# EAGLE design gpio4s5 (EAGLE 7.2.0)
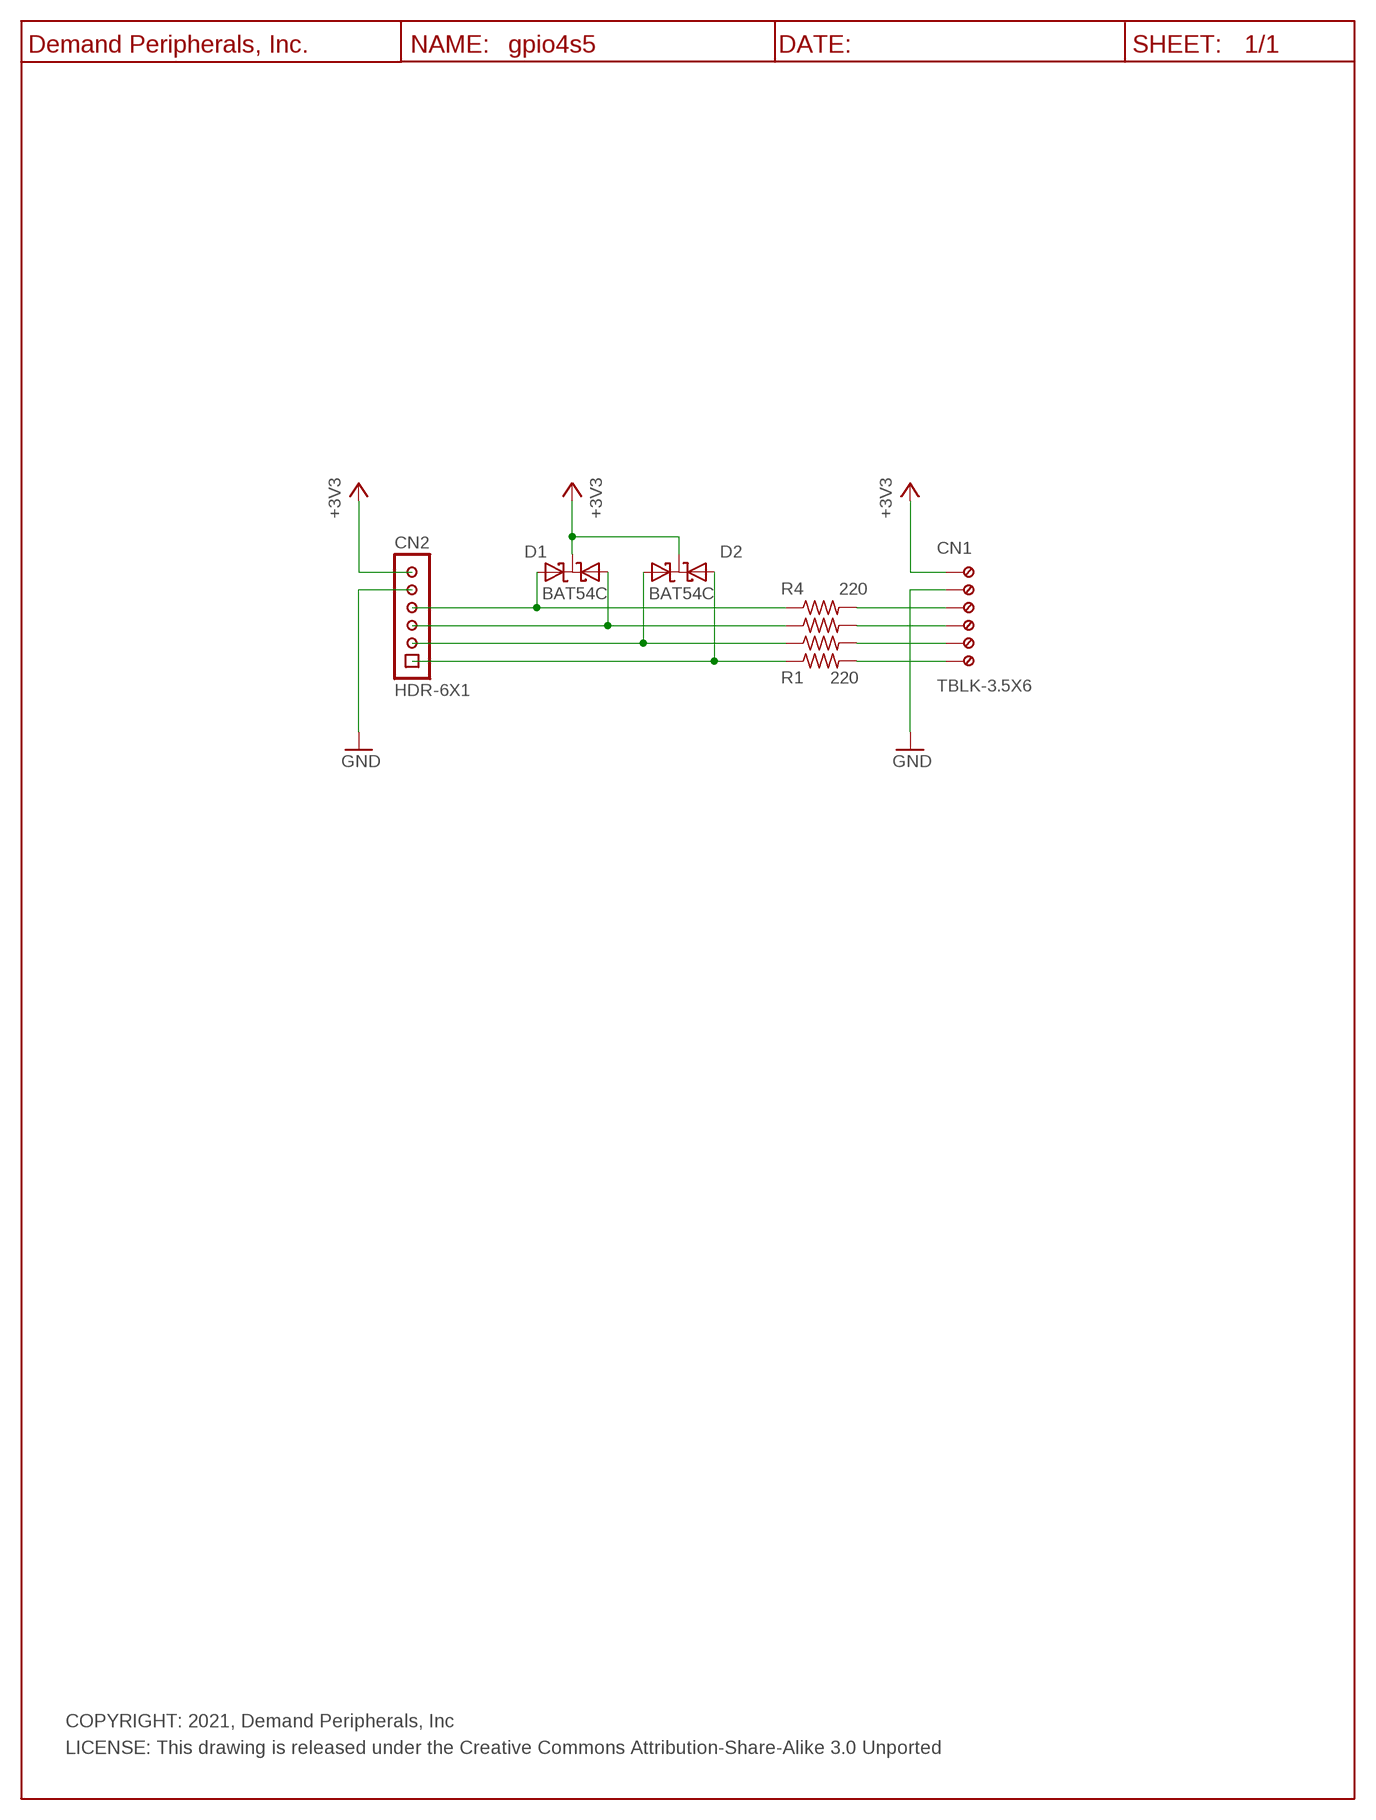
[diagram p0: schematic, sheet 1]

## Parts
CN1  TBLK-3.5X6  [TBLK-3.5X6]
CN2  HDR-6X1  [HDR-6X1]
D1  BAT54C  [SOT23]
D2  BAT54C  [SOT23]
R1  220  R220_R0603  [R0603]
R2  220  R220_R0603  [R0603]
R3  220  R220_R0603  [R0603]
R4  220  R220_R0603  [R0603]
U$1  DP_FRAME_P  [P_FRAME]

## Nets
+3V3: CN1.1(KL) CN2.6 D1.3(CC) D2.3(CC)
GND: CN1.2(KL1) CN2.5
N$1: CN1.3(KL2) R4.2
N$2: CN1.4(KL3) R3.2
N$3: CN1.5(KL4) R2.2
N$4: CN1.6(KL5) R1.2
N$11: CN2.4 D1.1(A1) R4.1
N$12: CN2.3 D1.2(A) R3.1
N$14: CN2.2 D2.1(A1) R2.1
N$15: CN2.1 D2.2(A) R1.1

## Notes on the sheet
- COPYRIGHT: 2021, Demand Peripherals, Inc
- LICENSE: This drawing is released under the Creative Commons Attribution-Share-Alike 3.0 Unported

## Library data of the parts
CN1 = dpi-conn:TBLK-3.5X6: Terminal block, 3.5mm, 6 position; VENDOR: Digikey; VENDOR-PART-NUM: ED2744-ND
CN2 = dpi-conn:HDR-6X1: 6x1 Pin header with pin 1 mark, no shroud, no lock; VENDOR: Digikey; VENDOR-PART-NUM: xxxxxxxxxx-ND
D1 D2 = dpi-diopto:BAT54C: BAT54C Dual Common Cathode Schottky; VENDOR: Digikey; VENDOR-PART-NUM: DB3X313N0LCT-ND
R1-R4 = dpi-passive:R220_: 220 Ohm resistor, 1%, 0.1 watt; VENDOR: Digikey; VENDOR-PART-NUM: 311-220HRTR-ND
U$1 = dpi-sym:DP_FRAME_P: Portrait/Letter Document Frame

## Board
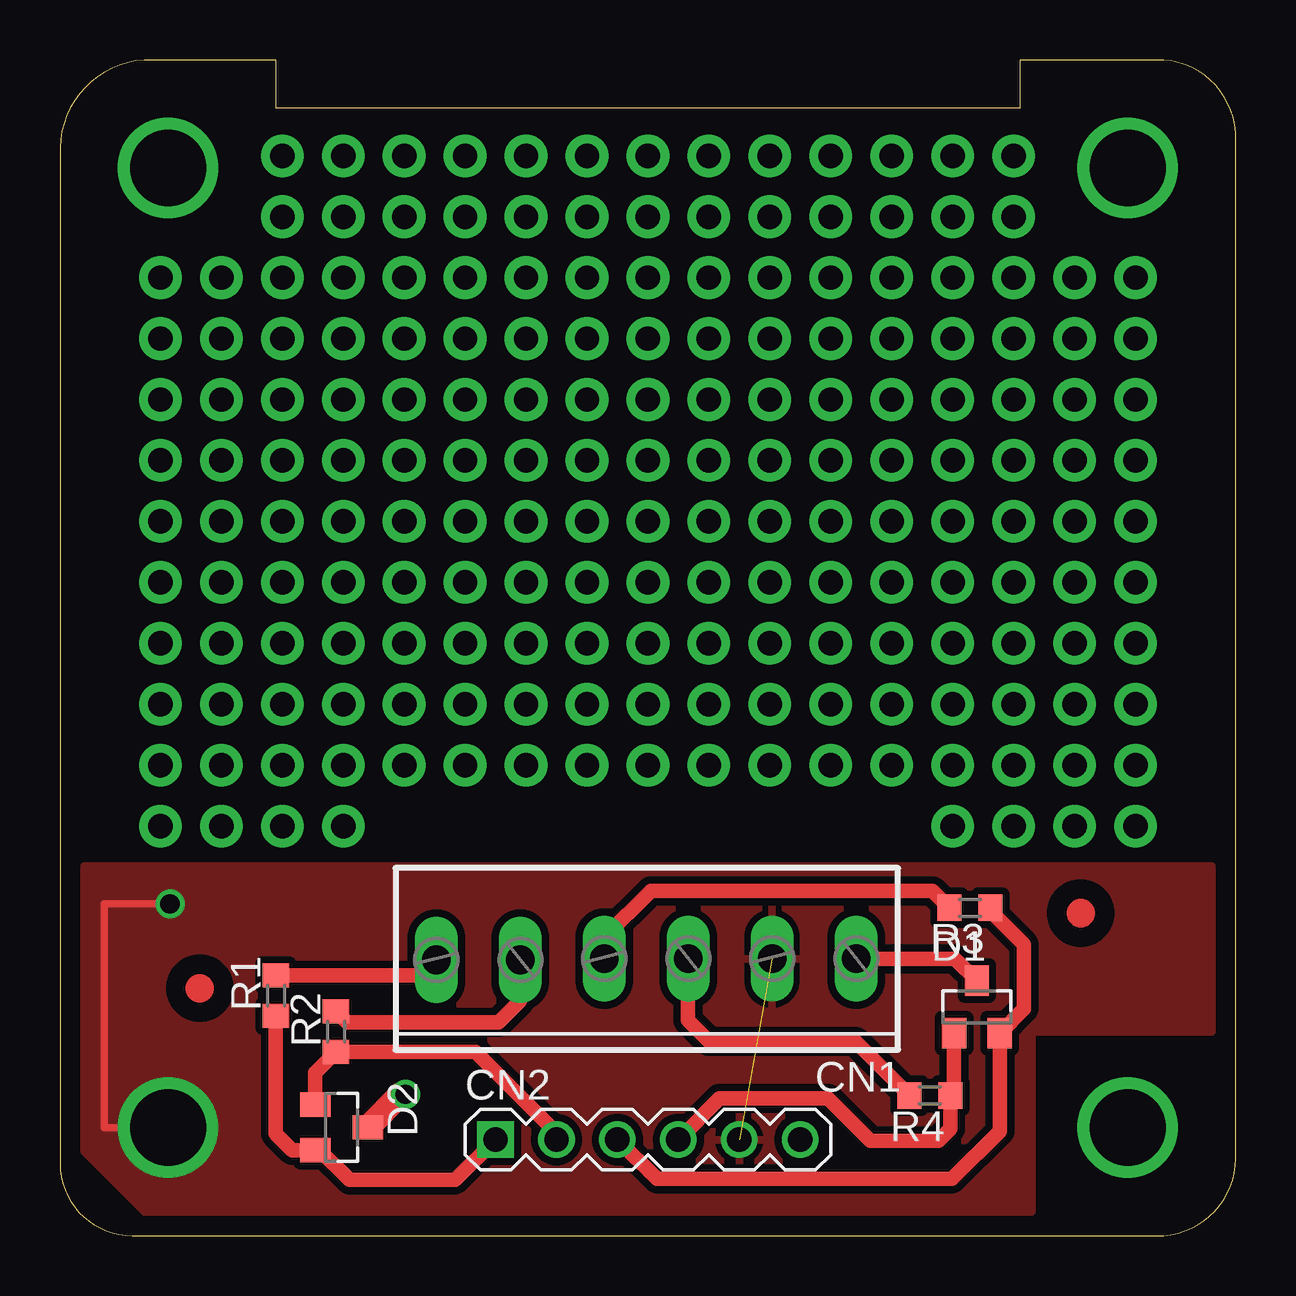
[diagram p1: board, top side]
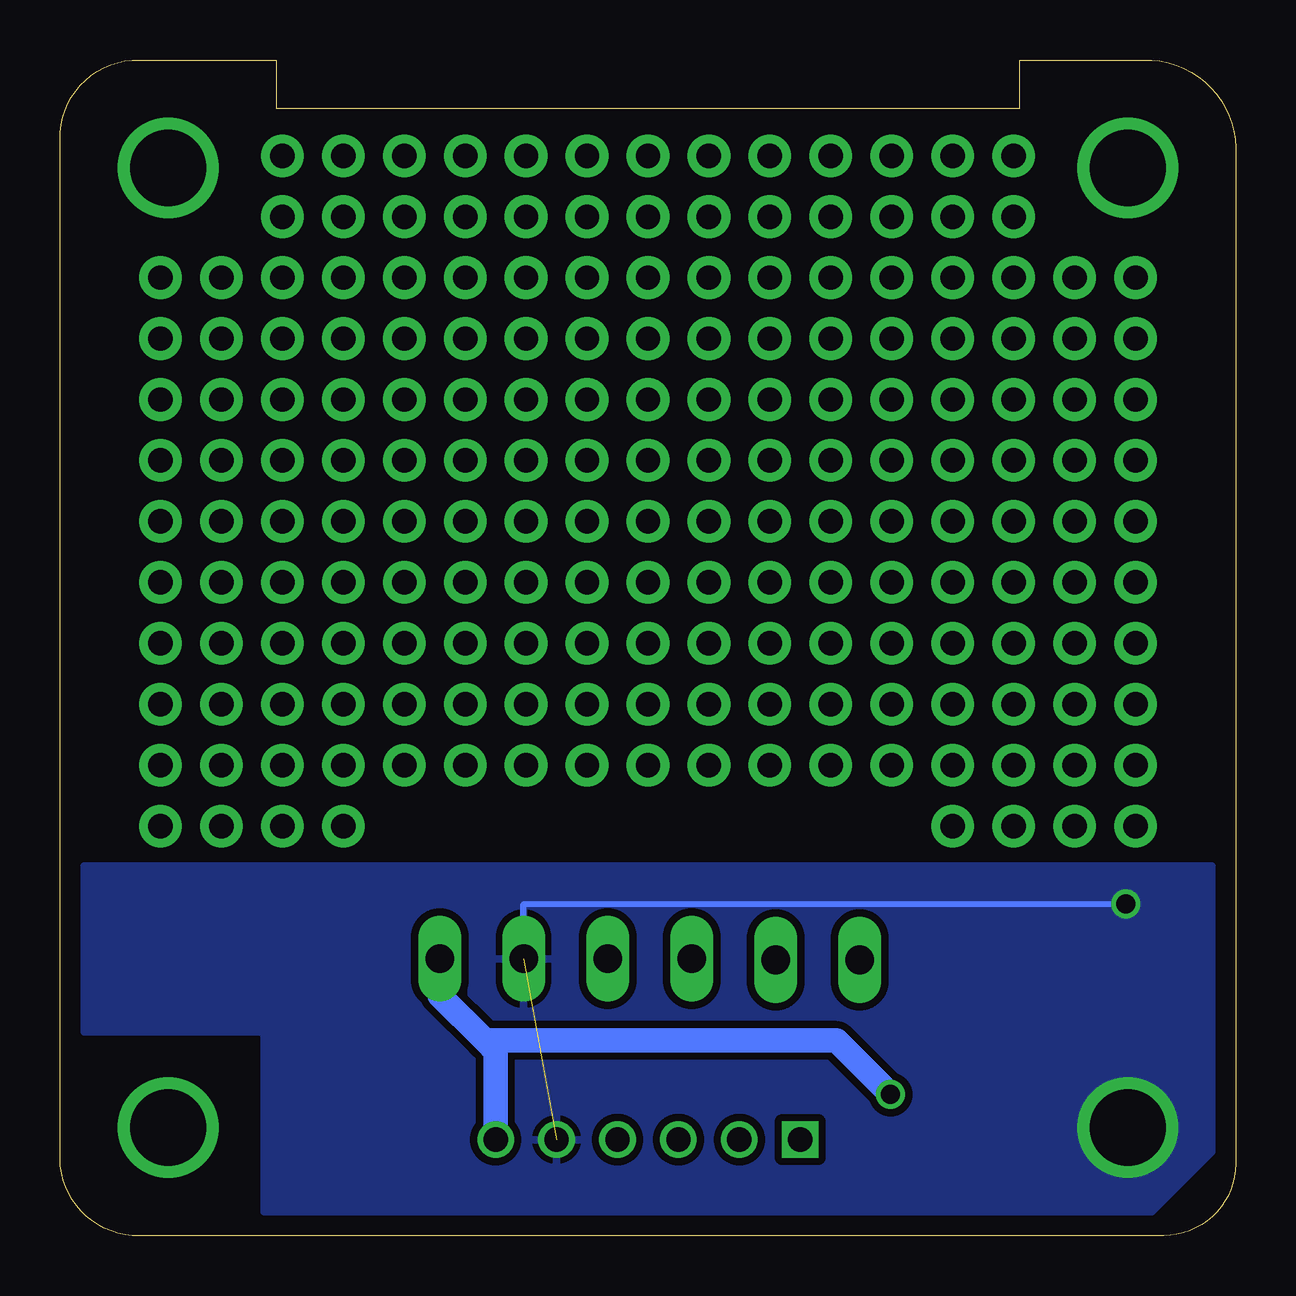
[diagram p2: board, bottom side, seen from below]

Size 49.02 x 49 mm. Coordinates in mm from the lower left corner, seen from the top.
Outline: 49.01,45.5 arc9 49.01,46
Outline: 49.01,46 arc81 46.01,49 40.01,49 40.01,47 9.01,47 9.01,49 3.51,49 arc90 0.01,45 0.01,3 arc90 3.01,0 46.01,0 arc90 49.01,3.5 49.01,46
Copper layers (1*16): Top 0.035mm / dielectric 1.5mm / Bottom 0.035mm
Design rules "default *": minimum track width 10mil, minimum drill 24mil, track to track 12mil, track to pad 12mil, pad to pad 12mil, via to via 12mil, smd to smd 12mil, copper to edge 20mil, drill to drill 8mil, minimum pad ring 10mil, minimum via ring 8mil, stop-mask expansion 4mil, vias tented up to drill 0mil, thermal gap 10mil

### Footprints (pad centres in the part's own frame; a part is rotated, then mirrored left to right if it is on the bottom)
TBLK-3.5X6 = drill 1.2 long: 1 -8.68,-0.04; 2 -5.18,-0.04; 3 -1.68,-0.04; 4 1.82,-0.04; 5 5.32,0.01; 6 8.82,0.01
HDR-6X1 = drill 1.016 square: 1 -6.35,0 | drill 1.016: 2 -3.81,0; 3 -1.27,0; 4 1.27,0; 5 3.81,0; 6 6.35,0
SOT23 = smd 1.016 x 1.27: 1 -0.95,-1.1; 2 0.95,-1.1; 3 0,1.1
R0603 = smd 1 x 1.1: 1 -0.85,0; 2 0.85,0

### Placement (x,y rotation side)
CN1  24.51,11.5 180 top
CN2  24.51,4 0 top
D1  38.22,9.53 0 top
D2  11.74,4.51 270 top
R1  9.01,10 90 top
R2  11.51,8.5 90 top
R3  37.93,13.66 180 top
R4  36.26,5.84 180 top
U$1  -2.53,-2.54 0 top
U$2  [DPI-2]  45.02,11.1 90 bottom
U$3  [FIDUCIAL]  5.83,10.31 0 top
U$8  [FIDUCIAL]  42.54,13.44 0 top

### Tracks (layer width: path | path; a pad name or v marks a point on that pad's centre or on a via)
+3V3  (via drill 0.8)
  Top 0.61: D1.3 37.31,11.54 CN1.1
  Top 1.016: D2.3 14.21,5.88 v14.4,5.88
  Bottom 1.016: v14.4,5.88 16.65,8.13 31.31,8.13 | CN2.6 30.86,7.68 31.31,8.13 | 31.31,8.13 33.19,10.01 CN1.1
GND  (via drill 0.8, 3.17)  (1 unrouted)
  Top 0.305: v4.59,13.82 1.84,13.82 1.84,6.73 1.84,4.5 v4.51,4.5
  Bottom 0.254: CN1.2 29.69,13.82 v4.59,13.82
  pour Bottom: 1.01,3.5 1.01,15.4 48.01,15.4 48.01,8.5 40.51,8.5 40.51,1 3.51,1
  pour Top: 1.01,3.5 1.01,15.4 48.01,15.4 48.01,8.5 40.51,8.5 40.51,1 3.51,1
MOUNT1  (via drill 3.17 pad 3.17)
  other vias: 44.51,44.5
N$1
  Top 0.61: R4.2 33.16,8.09 27.06,8.09 26.19,8.96 CN1.3
N$2
  Top 0.61: R3.2 36.37,14.37 24.64,14.37 22.69,12.42 CN1.4
N$3
  Top 0.61: R2.2 11.98,8.88 18.28,8.88 19.19,9.79 CN1.5
N$4
  Top 0.61: CN1.6 15.05,10.85 R1.2
N$5  (via drill 3.17 pad 3.17)
  other vias: 4.51,44.5
N$6  (via drill 3.17 pad 3.17)
  other vias: 44.51,4.5
N$11
  Top 0.61: D1.1 37.27,6 R4.1 37.11,4.44 36.62,3.95 33.78,3.95 32.01,5.72 27.5,5.72 CN2.4
N$12
  Top 0.61: CN2.3 24.88,2.36 37.19,2.36 39.17,4.34 D1.2 40.19,9.45 40.19,12.13 38.78,13.54 R3.1
N$14
  Top 0.61: CN2.2 20.7,4.28 19.49,5.49 17.33,7.65 13.17,7.65 R2.1 10.64,6.78 D2.1
N$15
  Top 0.61: CN2.1 16.48,2.32 12.07,2.32 10.83,3.56 D2.2 9.69,3.56 9,4.25 R1.1
WW1  (via drill 1.02 pad 1.78)
  other vias: 37.21,24.69
WW2  (via drill 1.02 pad 1.78)
  other vias: 37.21,29.77
WW3  (via drill 1.02 pad 1.78)
  other vias: 4.19,27.23
WW4  (via drill 1.02 pad 1.78)
  other vias: 4.19,24.69
WW5  (via drill 1.02 pad 1.78)
  other vias: 4.19,29.77
WW6  (via drill 1.02 pad 1.78)
  other vias: 4.19,32.31
WW7  (via drill 1.02 pad 1.78)
  other vias: 4.19,34.85
WW8  (via drill 1.02 pad 1.78)
  other vias: 4.19,37.39
WW9  (via drill 1.02 pad 1.78)
  other vias: 4.19,39.93
WW10  (via drill 1.02 pad 1.78)
  other vias: 39.75,24.69
WW11  (via drill 1.02 pad 1.78)
  other vias: 39.75,29.77
WW12  (via drill 1.02 pad 1.78)
  other vias: 4.19,22.15
WW13  (via drill 1.02 pad 1.78)
  other vias: 6.73,27.23
WW14  (via drill 1.02 pad 1.78)
  other vias: 9.27,27.23
WW15  (via drill 1.02 pad 1.78)
  other vias: 11.81,27.23
WW16  (via drill 1.02 pad 1.78)
  other vias: 6.73,24.69
WW17  (via drill 1.02 pad 1.78)
  other vias: 6.73,29.77
WW18  (via drill 1.02 pad 1.78)
  other vias: 6.73,32.31
WW19  (via drill 1.02 pad 1.78)
  other vias: 6.73,34.85
WW20  (via drill 1.02 pad 1.78)
  other vias: 6.73,37.39
WW21  (via drill 1.02 pad 1.78)
  other vias: 6.73,39.93
WW22  (via drill 1.02 pad 1.78)
  other vias: 42.29,24.69
WW23  (via drill 1.02 pad 1.78)
  other vias: 42.29,29.77
WW24  (via drill 1.02 pad 1.78)
  other vias: 14.35,27.23
WW25  (via drill 1.02 pad 1.78)
  other vias: 16.89,27.23
WW26  (via drill 1.02 pad 1.78)
  other vias: 19.43,27.23
WW27  (via drill 1.02 pad 1.78)
  other vias: 21.97,27.23
WW28  (via drill 1.02 pad 1.78)
  other vias: 9.27,24.69
WW29  (via drill 1.02 pad 1.78)
  other vias: 9.27,29.77
WW30  (via drill 1.02 pad 1.78)
  other vias: 9.27,32.31
WW31  (via drill 1.02 pad 1.78)
  other vias: 9.27,34.85
WW32  (via drill 1.02 pad 1.78)
  other vias: 9.27,37.39
WW33  (via drill 1.02 pad 1.78)
  other vias: 9.27,39.93
WW34  (via drill 1.02 pad 1.78)
  other vias: 9.27,42.47
WW35  (via drill 1.02 pad 1.78)
  other vias: 9.27,45.01
WW36  (via drill 1.02 pad 1.78)
  other vias: 44.83,24.69
WW37  (via drill 1.02 pad 1.78)
  other vias: 24.51,27.23
WW38  (via drill 1.02 pad 1.78)
  other vias: 27.05,27.23
WW39  (via drill 1.02 pad 1.78)
  other vias: 29.59,27.23
WW40  (via drill 1.02 pad 1.78)
  other vias: 11.81,24.69
WW41  (via drill 1.02 pad 1.78)
  other vias: 11.81,29.77
WW42  (via drill 1.02 pad 1.78)
  other vias: 11.81,32.31
WW43  (via drill 1.02 pad 1.78)
  other vias: 11.81,34.85
WW44  (via drill 1.02 pad 1.78)
  other vias: 11.81,37.39
WW45  (via drill 1.02 pad 1.78)
  other vias: 11.81,39.93
WW46  (via drill 1.02 pad 1.78)
  other vias: 11.81,42.47
WW47  (via drill 1.02 pad 1.78)
  other vias: 11.81,45.01
WW48  (via drill 1.02 pad 1.78)
  other vias: 44.83,29.77
WW49  (via drill 1.02 pad 1.78)
  other vias: 32.13,27.23
WW50  (via drill 1.02 pad 1.78)
  other vias: 4.19,19.61
WW51  (via drill 1.02 pad 1.78)
  other vias: 34.67,27.23
WW52  (via drill 1.02 pad 1.78)
  other vias: 14.35,24.69
WW53  (via drill 1.02 pad 1.78)
  other vias: 14.35,29.77
WW54  (via drill 1.02 pad 1.78)
  other vias: 14.35,32.31
WW55  (via drill 1.02 pad 1.78)
  other vias: 14.35,34.85
WW56  (via drill 1.02 pad 1.78)
  other vias: 14.35,37.39
WW57  (via drill 1.02 pad 1.78)
  other vias: 14.35,39.93
WW58  (via drill 1.02 pad 1.78)
  other vias: 14.35,42.47
WW59  (via drill 1.02 pad 1.78)
  other vias: 14.35,45.01
WW60  (via drill 1.02 pad 1.78)
  other vias: 37.21,27.23
WW61  (via drill 1.02 pad 1.78)
  other vias: 6.73,22.15
WW62  (via drill 1.02 pad 1.78)
  other vias: 39.75,27.23
WW63  (via drill 1.02 pad 1.78)
  other vias: 42.29,27.23
WW64  (via drill 1.02 pad 1.78)
  other vias: 16.89,24.69
WW65  (via drill 1.02 pad 1.78)
  other vias: 16.89,29.77
WW66  (via drill 1.02 pad 1.78)
  other vias: 16.89,32.31
WW67  (via drill 1.02 pad 1.78)
  other vias: 16.89,34.85
WW68  (via drill 1.02 pad 1.78)
  other vias: 16.89,37.39
WW69  (via drill 1.02 pad 1.78)
  other vias: 16.89,39.93
WW70  (via drill 1.02 pad 1.78)
  other vias: 16.89,42.47
WW71  (via drill 1.02 pad 1.78)
  other vias: 16.89,45.01
WW72  (via drill 1.02 pad 1.78)
  other vias: 6.73,19.61
WW73  (via drill 1.02 pad 1.78)
  other vias: 44.83,27.23
WW74  (via drill 1.02 pad 1.78)
  other vias: 9.27,19.61
WW75  (via drill 1.02 pad 1.78)
  other vias: 11.81,19.61
WW76  (via drill 1.02 pad 1.78)
  other vias: 19.43,24.69
WW77  (via drill 1.02 pad 1.78)
  other vias: 19.43,29.77
WW78  (via drill 1.02 pad 1.78)
  other vias: 19.43,32.31
WW79  (via drill 1.02 pad 1.78)
  other vias: 19.43,34.85
WW80  (via drill 1.02 pad 1.78)
  other vias: 19.43,37.39
WW81  (via drill 1.02 pad 1.78)
  other vias: 19.43,39.93
WW82  (via drill 1.02 pad 1.78)
  other vias: 19.43,42.47
WW83  (via drill 1.02 pad 1.78)
  other vias: 19.43,45.01
WW84  (via drill 1.02 pad 1.78)
  other vias: 14.35,19.61
WW85  (via drill 1.02 pad 1.78)
  other vias: 16.89,19.61
WW86  (via drill 1.02 pad 1.78)
  other vias: 19.43,19.61
WW87  (via drill 1.02 pad 1.78)
  other vias: 21.97,19.61
WW88  (via drill 1.02 pad 1.78)
  other vias: 21.97,24.69
WW89  (via drill 1.02 pad 1.78)
  other vias: 21.97,29.77
WW90  (via drill 1.02 pad 1.78)
  other vias: 21.97,32.31
WW91  (via drill 1.02 pad 1.78)
  other vias: 21.97,34.85
WW92  (via drill 1.02 pad 1.78)
  other vias: 21.97,37.39
WW93  (via drill 1.02 pad 1.78)
  other vias: 21.97,39.93
WW94  (via drill 1.02 pad 1.78)
  other vias: 21.97,42.47
WW95  (via drill 1.02 pad 1.78)
  other vias: 21.97,45.01
WW96  (via drill 1.02 pad 1.78)
  other vias: 24.51,19.61
WW97  (via drill 1.02 pad 1.78)
  other vias: 27.05,19.61
WW98  (via drill 1.02 pad 1.78)
  other vias: 29.59,19.61
WW99  (via drill 1.02 pad 1.78)
  other vias: 32.13,19.61
WW100  (via drill 1.02 pad 1.78)
  other vias: 24.51,24.69
WW101  (via drill 1.02 pad 1.78)
  other vias: 24.51,29.77
WW102  (via drill 1.02 pad 1.78)
  other vias: 24.51,32.31
WW103  (via drill 1.02 pad 1.78)
  other vias: 24.51,34.85
WW104  (via drill 1.02 pad 1.78)
  other vias: 24.51,37.39
WW105  (via drill 1.02 pad 1.78)
  other vias: 24.51,39.93
WW106  (via drill 1.02 pad 1.78)
  other vias: 24.51,42.47
WW107  (via drill 1.02 pad 1.78)
  other vias: 24.51,45.01
WW108  (via drill 1.02 pad 1.78)
  other vias: 34.67,19.61
WW109  (via drill 1.02 pad 1.78)
  other vias: 37.21,19.61
WW110  (via drill 1.02 pad 1.78)
  other vias: 39.75,19.61
WW111  (via drill 1.02 pad 1.78)
  other vias: 9.27,22.15
WW112  (via drill 1.02 pad 1.78)
  other vias: 27.05,24.69
WW113  (via drill 1.02 pad 1.78)
  other vias: 27.05,29.77
WW114  (via drill 1.02 pad 1.78)
  other vias: 27.05,32.31
WW115  (via drill 1.02 pad 1.78)
  other vias: 27.05,34.85
WW116  (via drill 1.02 pad 1.78)
  other vias: 27.05,37.39
WW117  (via drill 1.02 pad 1.78)
  other vias: 27.05,39.93
WW118  (via drill 1.02 pad 1.78)
  other vias: 27.05,42.47
WW119  (via drill 1.02 pad 1.78)
  other vias: 27.05,45.01
WW120  (via drill 1.02 pad 1.78)
  other vias: 42.29,19.61
WW121  (via drill 1.02 pad 1.78)
  other vias: 44.83,19.61
WW122  (via drill 1.02 pad 1.78)
  other vias: 4.19,17.07
WW123  (via drill 1.02 pad 1.78)
  other vias: 6.73,17.07
WW124  (via drill 1.02 pad 1.78)
  other vias: 29.59,24.69
WW125  (via drill 1.02 pad 1.78)
  other vias: 29.59,29.77
WW126  (via drill 1.02 pad 1.78)
  other vias: 29.59,32.31
WW127  (via drill 1.02 pad 1.78)
  other vias: 29.59,34.85
WW128  (via drill 1.02 pad 1.78)
  other vias: 29.59,37.39
WW129  (via drill 1.02 pad 1.78)
  other vias: 29.59,39.93
WW130  (via drill 1.02 pad 1.78)
  other vias: 29.59,42.47
WW131  (via drill 1.02 pad 1.78)
  other vias: 29.59,45.01
WW132  (via drill 1.02 pad 1.78)
  other vias: 9.27,17.07
WW133  (via drill 1.02 pad 1.78)
  other vias: 37.21,17.07
WW134  (via drill 1.02 pad 1.78)
  other vias: 39.75,17.07
WW135  (via drill 1.02 pad 1.78)
  other vias: 42.29,17.07
WW136  (via drill 1.02 pad 1.78)
  other vias: 32.13,24.69
WW137  (via drill 1.02 pad 1.78)
  other vias: 32.13,29.77
WW138  (via drill 1.02 pad 1.78)
  other vias: 32.13,32.31
WW139  (via drill 1.02 pad 1.78)
  other vias: 32.13,34.85
WW140  (via drill 1.02 pad 1.78)
  other vias: 32.13,37.39
WW141  (via drill 1.02 pad 1.78)
  other vias: 32.13,39.93
WW142  (via drill 1.02 pad 1.78)
  other vias: 32.13,42.47
WW143  (via drill 1.02 pad 1.78)
  other vias: 32.13,45.01
WW144  (via drill 1.02 pad 1.78)
  other vias: 44.83,17.07
WW145  (via drill 1.02 pad 1.78)
  other vias: 11.81,22.15
WW146  (via drill 1.02 pad 1.78)
  other vias: 14.35,22.15
WW147  (via drill 1.02 pad 1.78)
  other vias: 16.89,22.15
WW148  (via drill 1.02 pad 1.78)
  other vias: 34.67,24.69
WW149  (via drill 1.02 pad 1.78)
  other vias: 34.67,29.77
WW150  (via drill 1.02 pad 1.78)
  other vias: 34.67,32.31
WW151  (via drill 1.02 pad 1.78)
  other vias: 34.67,34.85
WW152  (via drill 1.02 pad 1.78)
  other vias: 34.67,37.39
WW153  (via drill 1.02 pad 1.78)
  other vias: 34.67,39.93
WW154  (via drill 1.02 pad 1.78)
  other vias: 34.67,42.47
WW155  (via drill 1.02 pad 1.78)
  other vias: 34.67,45.01
WW156  (via drill 1.02 pad 1.78)
  other vias: 19.43,22.15
WW157  (via drill 1.02 pad 1.78)
  other vias: 21.97,22.15
WW158  (via drill 1.02 pad 1.78)
  other vias: 24.51,22.15
WW159  (via drill 1.02 pad 1.78)
  other vias: 27.05,22.15
WW160  (via drill 1.02 pad 1.78)
  other vias: 29.59,22.15
WW161  (via drill 1.02 pad 1.78)
  other vias: 32.13,22.15
WW162  (via drill 1.02 pad 1.78)
  other vias: 37.21,32.31
WW163  (via drill 1.02 pad 1.78)
  other vias: 37.21,34.85
WW164  (via drill 1.02 pad 1.78)
  other vias: 37.21,37.39
WW165  (via drill 1.02 pad 1.78)
  other vias: 37.21,39.93
WW166  (via drill 1.02 pad 1.78)
  other vias: 37.21,42.47
WW167  (via drill 1.02 pad 1.78)
  other vias: 37.21,45.01
WW168  (via drill 1.02 pad 1.78)
  other vias: 37.21,22.15
WW169  (via drill 1.02 pad 1.78)
  other vias: 34.67,22.15
WW170  (via drill 1.02 pad 1.78)
  other vias: 39.75,22.15
WW171  (via drill 1.02 pad 1.78)
  other vias: 11.81,17.07
WW172  (via drill 1.02 pad 1.78)
  other vias: 42.29,22.15
WW174  (via drill 1.02 pad 1.78)
  other vias: 39.75,32.31
WW175  (via drill 1.02 pad 1.78)
  other vias: 39.75,34.85
WW176  (via drill 1.02 pad 1.78)
  other vias: 39.75,37.39
WW177  (via drill 1.02 pad 1.78)
  other vias: 39.75,39.93
WW178  (via drill 1.02 pad 1.78)
  other vias: 39.75,42.47
WW179  (via drill 1.02 pad 1.78)
  other vias: 39.75,45.01
WW180  (via drill 1.02 pad 1.78)
  other vias: 44.83,22.15
WW186  (via drill 1.02 pad 1.78)
  other vias: 42.29,32.31
WW187  (via drill 1.02 pad 1.78)
  other vias: 42.29,34.85
WW188  (via drill 1.02 pad 1.78)
  other vias: 42.29,37.39
WW189  (via drill 1.02 pad 1.78)
  other vias: 42.29,39.93
WW198  (via drill 1.02 pad 1.78)
  other vias: 44.83,32.31
WW199  (via drill 1.02 pad 1.78)
  other vias: 44.83,34.85
WW200  (via drill 1.02 pad 1.78)
  other vias: 44.83,37.39
WW201  (via drill 1.02 pad 1.78)
  other vias: 44.83,39.93

### Text on the board
tTest: 49 mm | 40 mm | GPIO4-ST, Rev 21A | 40 mm | 49 mm | 1 | 2 | 3 | 4 | Gnd | 33 | R3 | R1 | R2 | D1 | (C) 2021, Demand Peripherals, Inc. | R4 | D2